# Altium schematic sheet logMultiplier.SchDoc
size OrCAD B; SheetNumber: 4; SheetTotal: 6
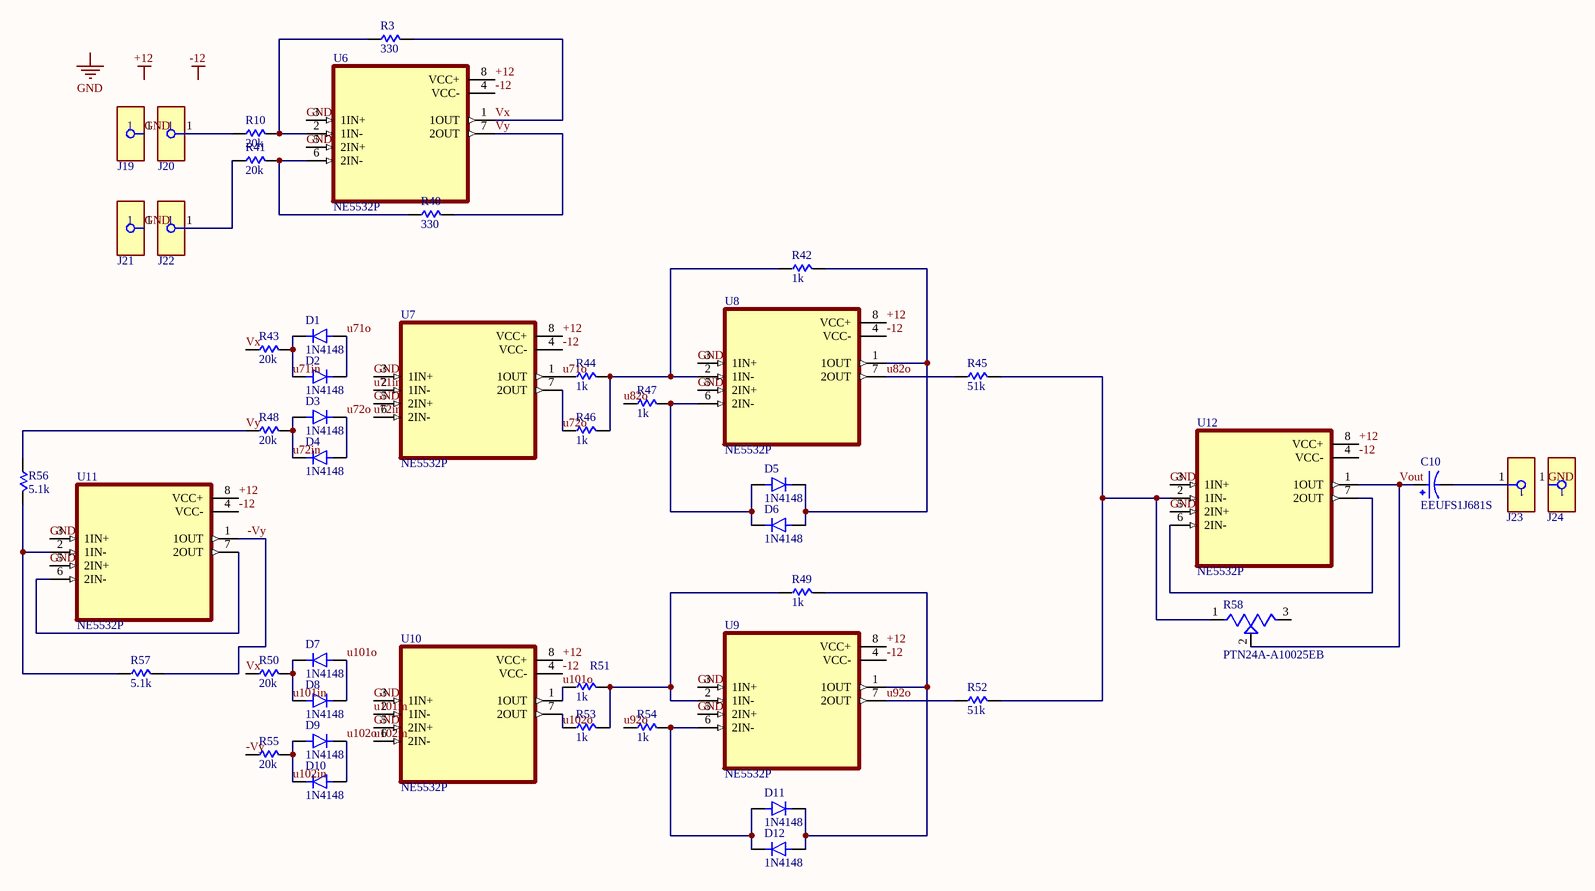
[diagram p0: logMultiplier.SchDoc]

## Parts
C10  EEUFS1J681S  [CAPPRD250W50D630H1250]
D1  1N4148  [DIOAD753W49L380D172B]
D2  1N4148  [DIOAD753W49L380D172B]
D3  1N4148  [DIOAD753W49L380D172B]
D4  1N4148  [DIOAD753W49L380D172B]
D5  1N4148  [DIOAD753W49L380D172B]
D6  1N4148  [DIOAD753W49L380D172B]
D7  1N4148  [DIOAD753W49L380D172B]
D8  1N4148  [DIOAD753W49L380D172B]
D9  1N4148  [DIOAD753W49L380D172B]
D10  1N4148  [DIOAD753W49L380D172B]
D11  1N4148  [DIOAD753W49L380D172B]
D12  1N4148  [DIOAD753W49L380D172B]
J19  1581-5  [FP-1581-5-MFG]  (value not drawn)
J20  1581-5  [FP-1581-5-MFG]  (value not drawn)
J21  1581-5  [FP-1581-5-MFG]  (value not drawn)
J22  1581-5  [FP-1581-5-MFG]  (value not drawn)
J23  1581-5  [FP-1581-5-MFG]  (value not drawn)
J24  1581-5  [FP-1581-5-MFG]  (value not drawn)
R3  value 330  [RESAD1100W55L680D260]  (hidden comment: MFR-25FBF52-1K)
R10  value 20k  [RESAD1100W55L680D260]  (hidden comment: MFR-25FBF52-1K)
R40  value 330  [RESAD1100W55L680D260]  (hidden comment: MFR-25FBF52-1K)
R41  value 20k  [RESAD1100W55L680D260]  (hidden comment: MFR-25FBF52-1K)
R42  value 1k  [RESAD1100W55L680D260]  (hidden comment: MFR-25FBF52-1K)
R43  value 20k  [RESAD1100W55L680D260]  (hidden comment: MFR-25FBF52-1K)
R44  value 1k  [RESAD1100W55L680D260]  (hidden comment: MFR-25FBF52-1K)
R45  value 51k  [RESAD1100W55L680D260]  (hidden comment: MFR-25FBF52-1K)
R46  value 1k  [RESAD1100W55L680D260]  (hidden comment: MFR-25FBF52-1K)
R47  value 1k  [RESAD1100W55L680D260]  (hidden comment: MFR-25FBF52-1K)
R48  value 20k  [RESAD1100W55L680D260]  (hidden comment: MFR-25FBF52-1K)
R49  value 1k  [RESAD1100W55L680D260]  (hidden comment: MFR-25FBF52-1K)
R50  value 20k  [RESAD1100W55L680D260]  (hidden comment: MFR-25FBF52-1K)
R51  value 1k  [RESAD1100W55L680D260]  (hidden comment: MFR-25FBF52-1K)
R52  value 51k  [RESAD1100W55L680D260]  (hidden comment: MFR-25FBF52-1K)
R53  value 1k  [RESAD1100W55L680D260]  (hidden comment: MFR-25FBF52-1K)
R54  value 1k  [RESAD1100W55L680D260]  (hidden comment: MFR-25FBF52-1K)
R55  value 20k  [RESAD1100W55L680D260]  (hidden comment: MFR-25FBF52-1K)
R56  value 5.1k  [RESAD1100W55L680D260]  (hidden comment: MFR-25FBF52-1K)
R57  value 5.1k  [RESAD1100W55L680D260]  (hidden comment: MFR-25FBF52-1K)
R58  PTN24A-A10025EB  [TRIM_PTN24A-A10025EB]
U6  NE5532P  [DIP794W45P254L959H508Q8]
U7  NE5532P  [DIP794W45P254L959H508Q8]
U8  NE5532P  [DIP794W45P254L959H508Q8]
U9  NE5532P  [DIP794W45P254L959H508Q8]
U10  NE5532P  [DIP794W45P254L959H508Q8]
U11  NE5532P  [DIP794W45P254L959H508Q8]
U12  NE5532P  [DIP794W45P254L959H508Q8]

## Nets
+12: U6.8(VCC+) U7.8(VCC+) U8.8(VCC+) U9.8(VCC+) U10.8(VCC+) U11.8(VCC+) U12.8(VCC+)
-12: U6.4(VCC-) U7.4(VCC-) U8.4(VCC-) U9.4(VCC-) U10.4(VCC-) U11.4(VCC-) U12.4(VCC-)
GND: J19.1 J21.1 J24.1 U6.3(1IN+) U6.5(2IN+) U7.3(1IN+) U7.5(2IN+) U8.3(1IN+) U8.5(2IN+) U9.3(1IN+) U9.5(2IN+) U10.3(1IN+) U10.5(2IN+) U11.3(1IN+) U11.5(2IN+) U12.3(1IN+) U12.5(2IN+)
-Vy: R55.1 R57.2 U11.1(1OUT)
u71in: D1.K D2.A R43.2 U7.2(1IN-)
u71o: D1.A D2.K R44.1 U7.1(1OUT)
u72in: D3.A D4.K R48.2 U7.6(2IN-)
u72o: D3.K D4.A R46.1 U7.7(2OUT)
u82o: R45.1 R47.1 U8.7(2OUT)
u92o: R52.1 R54.1 U9.7(2OUT)
u101in: D7.K D8.A R50.2 U10.2(1IN-)
u101o: D7.A D8.K R51.1 U10.1(1OUT)
u102in: D9.A D10.K R55.2 U10.6(2IN-)
u102o: D9.K D10.A R53.1 U10.7(2OUT)
Vout: C10.P R58.2 U12.1(1OUT)
Vx: R3.2 R43.1 R50.1 U6.1(1OUT)
Vy: R40.2 R48.1 R56.1 U6.7(2OUT)
NetC10_N: C10.N J23.1
NetD5_A: D5.A D6.K R47.2 U8.6(2IN-)
NetD5_K: D5.K D6.A R42.2 U8.1(1OUT)
NetD11_A: D11.A D12.K R54.2 U9.6(2IN-)
NetD11_K: D11.K D12.A R49.2 U9.1(1OUT)
NetJ20_1: J20.1 R10.1
NetJ22_1: J22.1 R41.1
NetR3_1: R3.1 R10.2 U6.2(1IN-)
NetR40_1: R40.1 R41.2 U6.6(2IN-)
NetR42_1: R42.1 R44.2 R46.2 U8.2(1IN-)
NetR45_2: R45.2 R52.2 R58.1 U12.2(1IN-)
NetR49_1: R49.1 R51.2 R53.2 U9.2(1IN-)
NetR56_2: R56.2 R57.1 U11.2(1IN-)
NetU11_6: U11.6(2IN-) U11.7(2OUT)
NetU12_6: U12.6(2IN-) U12.7(2OUT)

Not connected (* = marked no-connect by the designer): R58 3

## Notes on the sheet
- Labels drawn without touching a wire or pin: +12, -12, GND

## Library data of the parts
C10 = EEUFS1J681S: CAP ALUM 680UF 20% 63V THRU HOLE; MP: EEU-FS1J681S; MF: Panasonic Electronic Components; Package: RADIAL-2 Panasonic; Availability: In Stock; SnapEDA_Link: https://www.snapeda.com/parts/EEU-FS1J681S/Panasonic/view-part/5562022/?ref=snap; Price: None; Check_prices: https://www.snapeda.com/parts/EEU-FS1J681S/Panasonic/view-part/5562022/?ref=eda; Value: *
D1-D12 = 1N4148: Diode Standard 75V 200mA Surface Mount SOD-523F; MF: ON Semiconductor; SnapEDA_Link: https://www.snapeda.com/parts/1N4148/Onsemi/view-part/?ref=snap; Package: AXIAL LEAD-2 ON Semiconductor; Value: *; MP: 1N4148; Check_prices: https://www.snapeda.com/parts/1N4148/Onsemi/view-part/?ref=eda
J19-J24 = CMP-73906-000011-1: CONN BANANA JACK TURRET GREEN; Body Material: PC; Number of Contacts: 1; Max Current Rating: 15A; Voltage Rating (AC): 30V; Insulation: Mating End Insulated; Voltage Rating: 2.5kV; Voltage Rating (DC): 60V; Gender: Female; Height: 0.25inch; Mount: Panel; RoHS Compliant: Yes; Length: 1.22inch; Orientation: Straight; Diameter: 4.22mm; Lead Free: Lead Free; Package Quantity: 1; Termination: Turret; Current Rating: 15A; Packaging: Bag; Series: 1581; REACH SVHC: No SVHC; Number of Positions: 1; Contact Plating: Tin; Housing Color: Green; Contact Material: Brass; Insulation Material: Polycarbonate; Weight: 0.126lb; Number of Ports: 1; Color: Green; Housing Material: Polycarbonate; Width: 4inch
R3 R10 R40-R57 = MFR-25FBF52-1K: 1.07 kOhms Â±1% 0.25W, 1/4W Through Hole Resistor Axial - Metal Film; MF: Yageo; SnapEDA_Link: https://www.snapeda.com/parts/MFR-25FBF52-1K/Yageo/view-part/?ref=snap; Package: RADIAL-2 YAGEO; MP: MFR-25FBF52-1K; Check_prices: https://www.snapeda.com/parts/MFR-25FBF52-1K/Yageo/view-part/?ref=eda
R58 = PTN24A-A10025EB: 100k Ohm 1 Gang Linear Panel Mount Potentiometer 1.0 Turns Carbon 0.5W, 1/2W PC Pins; MF: Same Sky; SnapEDA_Link: https://www.snapeda.com/parts/PTN24A-A10025EB/Same+Sky/view-part/?ref=snap; Package: Package; Value: *; MP: PTN24A-A10025EB; Check_prices: https://www.snapeda.com/parts/PTN24A-A10025EB/Same+Sky/view-part/?ref=eda
U6-U12 = NE5532P: Dual, 30-V, 10-MHz, low-noise operational amplifier for audio applications; MF: Texas Instruments; SnapEDA_Link: https://www.snapeda.com/parts/NE5532P/Texas+Instruments/view-part/?ref=snap; Package: PDIP-8 Texas; Value: *; MP: NE5532P; Check_prices: https://www.snapeda.com/parts/NE5532P/Texas+Instruments/view-part/?ref=eda